# EAGLE design rev3-noserial (EAGLE 9.7.0)
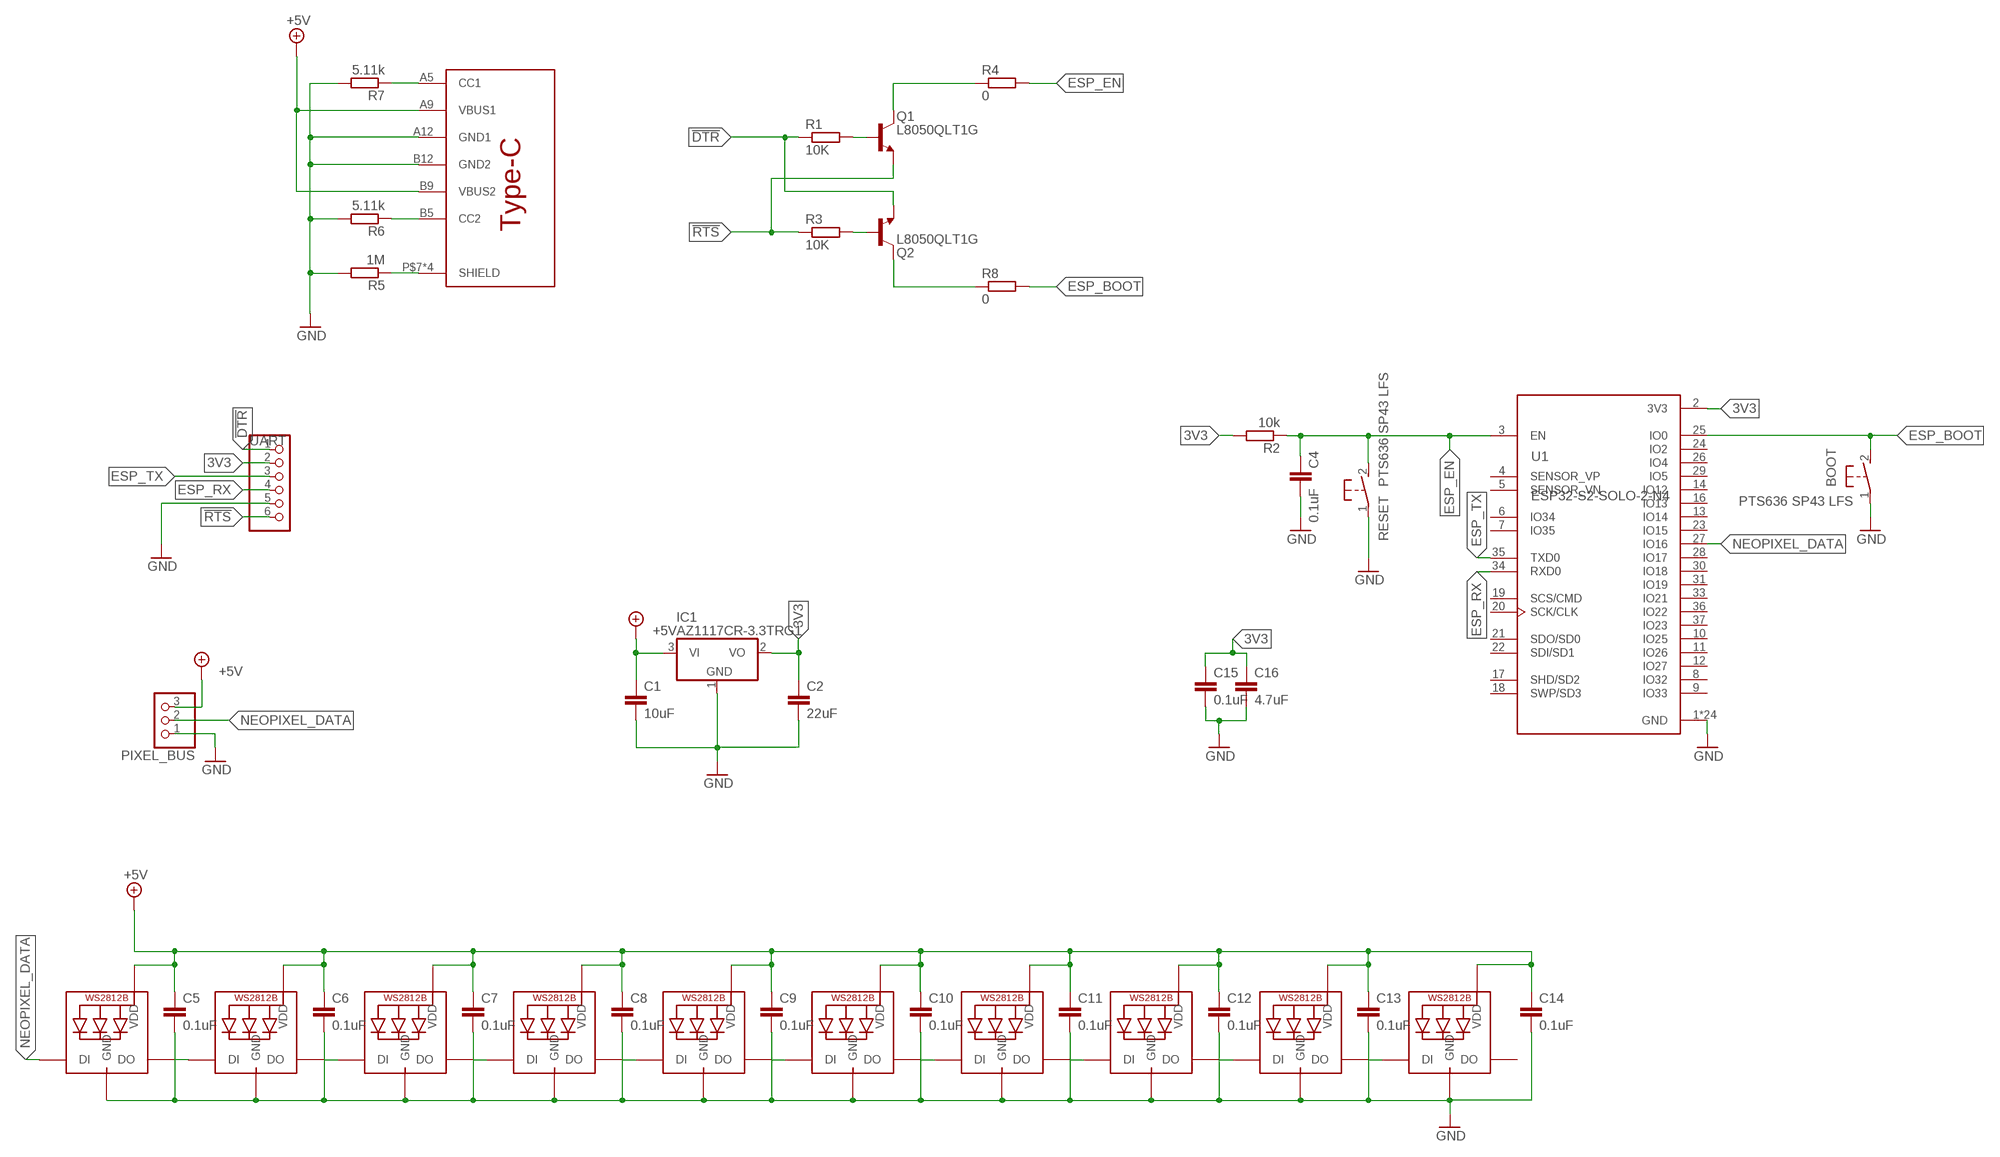
[diagram p0: schematic, sheet 1]

## Parts
BOOT  PTS636 SP43 LFS  PTS636SP43LFS  [PTS636SP43LFS]
C1  10uF  C-EUC0805  [C0805]
C2  22uF  C-EUC0805  [C0805]
C4  0.1uF  C-EUC0805  [C0805]
C5  0.1uF  C-EUC0805  [C0805]
C6  0.1uF  C-EUC0805  [C0805]
C7  0.1uF  C-EUC0805  [C0805]
C8  0.1uF  C-EUC0805  [C0805]
C9  0.1uF  C-EUC0805  [C0805]
C10  0.1uF  C-EUC0805  [C0805]
C11  0.1uF  C-EUC0805  [C0805]
C12  0.1uF  C-EUC0805  [C0805]
C13  0.1uF  C-EUC0805  [C0805]
C14  0.1uF  C-EUC0805  [C0805]
C15  0.1uF  C-EUC0805  [C0805]
C16  4.7uF  C-EUC0805  [C0805]
IC1  AZ1117CR-3.3TRG1  AZ1117CR  [SOT89]
LED1  WS2812B5050  [WS2812B]
LED2  WS2812B5050  [WS2812B]
LED3  WS2812B5050  [WS2812B]
LED4  WS2812B5050  [WS2812B]
LED5  WS2812B5050  [WS2812B]
LED6  WS2812B5050  [WS2812B]
LED7  WS2812B5050  [WS2812B]
LED8  WS2812B5050  [WS2812B]
LED9  WS2812B5050  [WS2812B]
LED10  WS2812B5050  [WS2812B]
PIXEL_BUS  PINHD-1X3  [1X03]
Q1  L8050QLT1G  NPN_BC846A,215_SOT23-BEC  [SOT95P237X112-3N]
Q2  L8050QLT1G  NPN_BC846A,215_SOT23-BEC  [SOT95P237X112-3N]
R1  10K  R-EU_R0805  [R0805]
R2  10k  R-EU_R0805  [R0805]
R3  10K  R-EU_R0805  [R0805]
R4  0  R-EU_R0805  [R0805]
R5  1M  R-EU_R0805  [R0805]
R6  5.11k  R-EU_R0805  [R0805]
R7  5.11k  R-EU_R0805  [R0805]
R8  0  R-EU_R0805  [R0805]
RESET  PTS636 SP43 LFS  PTS636SP43LFS  [PTS636SP43LFS]
U1  ESP32-S2-SOLO-2-N4  ESP32-WROOM-32D  [MODULE_ESP32-WROOM-32D]
U$1  TYPEC-DB-104PWB  [TYPEC-DB-104PWB]
UART  PINHD-1X6  [1X06]

## Nets
3V3 [power]: C2.1 C15.1 C16.1 IC1.2(VO) R2.2 U1.2(3V3) UART.2
!DTR: Q2.2(E) R1.1 UART.1
!RTS: Q1.2(E) R3.1 UART.6
+5V [power]: C1.1 C5.1 C6.1 C7.1 C8.1 C9.1 C10.1 C11.1 C12.1 C13.1 C14.1 IC1.3(VI) LED1.1-VDD(VDD) LED2.1-VDD(VDD) LED3.1-VDD(VDD) LED4.1-VDD(VDD) LED5.1-VDD(VDD) LED6.1-VDD(VDD) LED7.1-VDD(VDD) LED8.1-VDD(VDD) LED9.1-VDD(VDD) LED10.1-VDD(VDD) PIXEL_BUS.3 U$1.A9(VBUS1) U$1.B9(VBUS2)
ESP_BOOT: BOOT.2 R8.2 U1.25(IO0)
ESP_EN: C4.1 R2.1 R4.2 RESET.2 U1.3(EN)
ESP_RX: U1.34(RXD0) UART.4
ESP_TX: U1.35(TXD0) UART.3
GND [power]: BOOT.1 C1.2 C2.2 C4.2 C5.2 C6.2 C7.2 C8.2 C9.2 C10.2 C11.2 C12.2 C13.2 C14.2 C15.2 C16.2 IC1.1(GND) LED1.3-GND(GND) LED2.3-GND(GND) LED3.3-GND(GND) LED4.3-GND(GND) LED5.3-GND(GND) LED6.3-GND(GND) LED7.3-GND(GND) LED8.3-GND(GND) LED9.3-GND(GND) LED10.3-GND(GND) PIXEL_BUS.1 R5.2 R6.2 R7.2 RESET.1 U1.1(GND) U1.15(GND) U1.38(GND) U1.39_1(GND) U1.39_2(GND) U1.39_3(GND) U1.39_4(GND) U1.39_5(GND) U1.39_6(GND) U1.39_7(GND) U1.39_8(GND) U1.39_9(GND) U1.39_10(GND) U1.39_11(GND) U1.39_12(GND) U1.39_13(GND) U1.39_14(GND) U1.39_15(GND) U1.39_16(GND) U1.39_17(GND) U1.39_18(GND) U1.39_19(GND) U1.39_20(GND) U1.39_21(GND) U$1.A12(GND1) U$1.B12(GND2) UART.5
N$1: R6.1 U$1.B5(CC2)
N$2: R5.1 U$1.P$7(SHIELD) U$1.P$8(SHIELD) U$1.P$9(SHIELD) U$1.P$10(SHIELD)
N$3: R7.1 U$1.A5(CC1)
N$4: LED2.2-DOUT(DO) LED3.4-DIN(DI)
N$5: Q1.1(B) R1.2
N$6: Q2.1(B) R3.2
N$8: LED3.2-DOUT(DO) LED4.4-DIN(DI)
N$10: Q1.3(C) R4.1
N$11: Q2.3(C) R8.1
N$12: LED4.2-DOUT(DO) LED5.4-DIN(DI)
N$16: LED5.2-DOUT(DO) LED6.4-DIN(DI)
N$17: LED6.2-DOUT(DO) LED7.4-DIN(DI)
N$18: LED7.2-DOUT(DO) LED8.4-DIN(DI)
N$19: LED8.2-DOUT(DO) LED9.4-DIN(DI)
N$20: LED9.2-DOUT(DO) LED10.4-DIN(DI)
N$21: LED1.2-DOUT(DO) LED2.4-DIN(DI)
NEOPIXEL_DATA: LED1.4-DIN(DI) PIXEL_BUS.2 U1.27(IO16)
Unconnected: LED10.2-DOUT(DO) U1.4(SENSOR_VP) U1.5(SENSOR_VN) U1.6(IO34) U1.7(IO35) U1.8(IO32) U1.9(IO33) U1.10(IO25) U1.11(IO26) U1.12(IO27) U1.13(IO14) U1.14(IO12) U1.16(IO13) U1.17(SHD/SD2) U1.18(SWP/SD3) U1.19(SCS/CMD) U1.20(SCK/CLK) U1.21(SDO/SD0) U1.22(SDI/SD1) U1.23(IO15) U1.24(IO2) U1.26(IO4) U1.28(IO17) U1.29(IO5) U1.30(IO18) U1.31(IO19) U1.33(IO21) U1.36(IO22) U1.37(IO23)

## Library data of the parts
BOOT RESET = flameeyes:PTS636SP43LFS
C1 C2 C4-C16 = rcl:C-EU: CAPACITOR, European symbol; SPICEPREFIX: C
IC1 = flameeyes:AZ1117C
LED1-LED10 = flameeyes:WS2812B
PIXEL_BUS = pinhead:PINHD-1X3: PIN HEADER
Q1 Q2 = Transistor:NPN_: NPN - Popular parts; CATEGORY: Transistor; DESCRIPTION: TRANS NPN 65V 0.1A SOT23; MANUFACTURER: Nexperia USA Inc.; SUB-CATEGORY: BJT; TYPE: NPN; VALUE: BC846A
R1-R8 = rcl:R-EU_: RESISTOR, European symbol; SPICEPREFIX: R
U1 = ESP32-WROOM-32D:ESP32-WROOM-32D: Bluetooth, WiFi 802.11b/g/n, Bluetooth v4.2 + EDR, Class 1, 2 and 3 Transceiver Module 2.4GHz ~ 2.5GHz Integrated, Trace Surface Mount Check availability <https://pricing.snapeda.com/parts/ESP32-WROOM-32D/Espressif%20Systems/view-part?ref=eda>; AVAILABILITY: In Stock; DESCRIPTION: Bluetooth, WiFi 802.11b/g/n, Bluetooth v4.2 +EDR, Class 1, 2 and 3 Transceiver Module 2.4GHz ~ 2.5GHz Integrated; MF: Espressif Systems; MP: ESP32-WROOM-32D; PACKAGE: Non Standard Espressif Systems; PRICE: None
U$1 = flameeyes:TYPEC-DB-104PWB; JLCPCBPART#: C2936180
UART = pinhead:PINHD-1X6: PIN HEADER

## Net classes
0 default: clearance 0.205 mm
1 power: width 0.051 mm, clearance 0.205 mm to class 0, clearance 0.205 mm

## Board
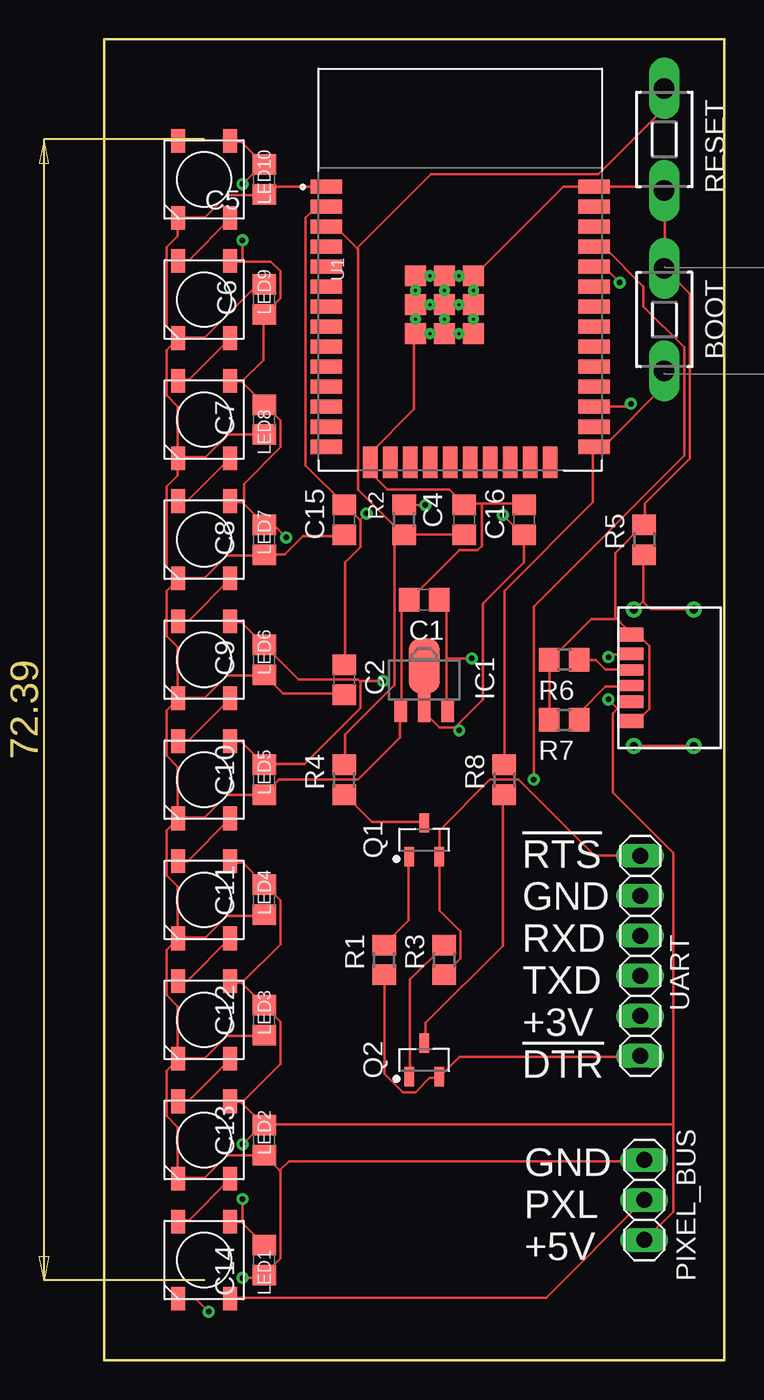
[diagram p1: board, top side]
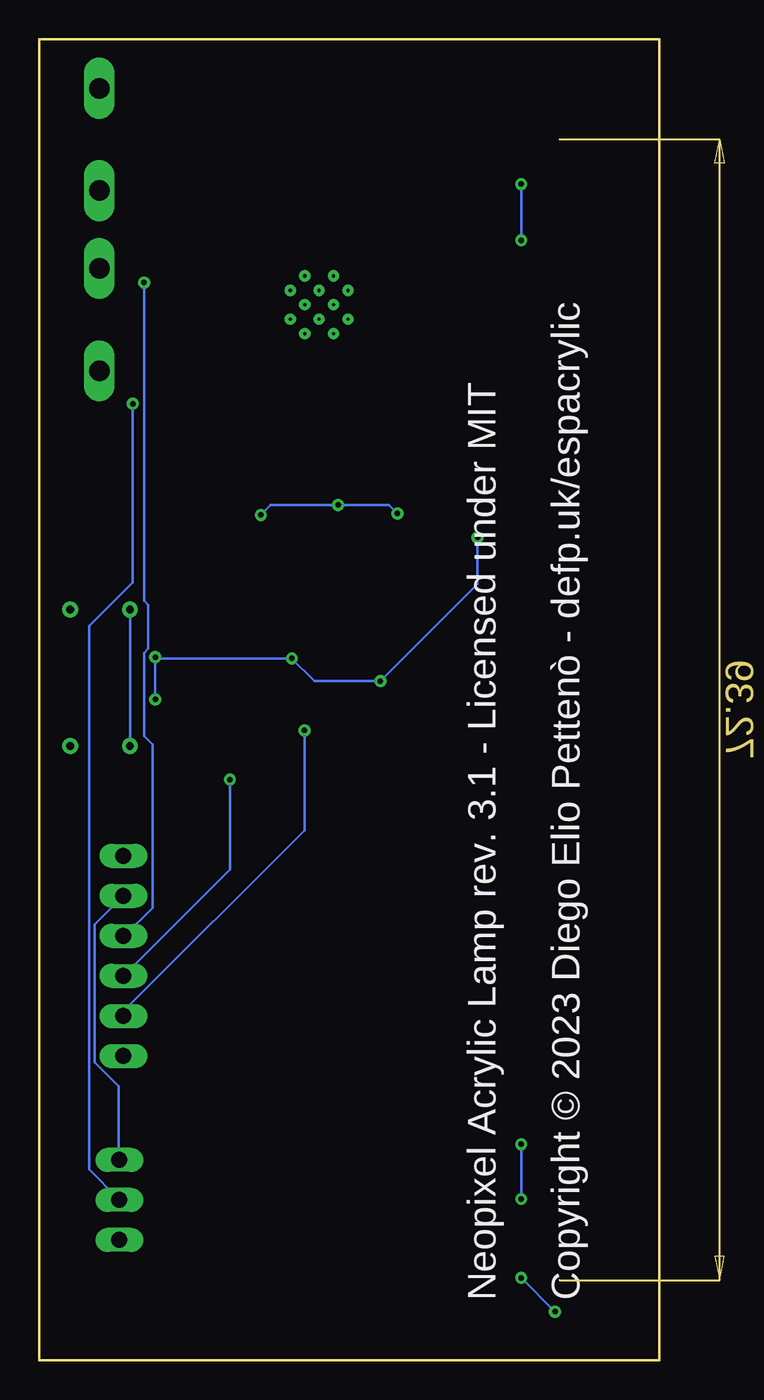
[diagram p2: board, bottom side, seen from below]

Size 39.37 x 83.82 mm. Coordinates in mm from the lower left corner, seen from the top.
Outline: 0,0 39.37,0 39.37,83.82 0,83.82 0,0
Copper layers (1*16): Top 0.035mm / dielectric 1.5mm / Bottom 0.035mm
Design rules "default": minimum track width 6mil, minimum drill 0.35mm, track to track 6mil, track to pad 6mil, pad to pad 6mil, via to via 6mil, smd to smd 6mil, copper to edge 40mil, drill to drill 6mil, minimum pad ring 10mil, minimum via ring 8mil, stop-mask expansion 4mil, vias tented up to drill 0mil, thermal gap 10mil

### Footprints (pad centres in the part's own frame; a part is rotated, then mirrored left to right if it is on the bottom)
PTS636SP43LFS = drill 1.3 long: 1 -3.25,0; 2 3.25,0
C0805 = smd 1.3 x 1.5: 1 -0.95,0; 2 0.95,0
SOT89 = smd 0.8 x 1.4: 1 -1.499,-1.981; 3 1.499,-1.981 | smd 0.8 x 1.9: 2 0,-1.727 | smd 2 x 3.5: 2.1 0,0.889
WS2812B = smd 1.5 x 0.9: 1-VDD -2.45,1.65; 2-DOUT -2.45,-1.65; 3-GND 2.45,-1.65; 4-DIN 2.45,1.65
1X03 = drill 1.016 long: 1 -2.54,0; 2 0,0; 3 2.54,0
SOT95P237X112-3N = smd 1.224 x 0.625: 1 -1.064,0.95; 2 -1.064,-0.95; 3 1.064,0
R0805 = smd 1.3 x 1.5: 1 -0.95,0; 2 0.95,0
MODULE_ESP32-WROOM-32D = smd 2 x 0.9: 1 -8.5,5.26; 2 -8.5,3.99; 3 -8.5,2.72; 4 -8.5,1.45; 5 -8.5,0.18; 6 -8.5,-1.09; 7 -8.5,-2.36; 8 -8.5,-3.63; 9 -8.5,-4.9; 10 -8.5,-6.17; 11 -8.5,-7.44; 12 -8.5,-8.71; 13 -8.5,-9.98; 14 -8.5,-11.25; 25 8.5,-11.25; 26 8.5,-9.98; 27 8.5,-8.71; 28 8.5,-7.44; 29 8.5,-6.17; 30 8.5,-4.9; 31 8.5,-3.63; 32 8.5,-2.36; 33 8.5,-1.09; 34 8.5,0.18; 35 8.5,1.45; 36 8.5,2.72; 37 8.5,3.99; 38 8.5,5.26 | smd 0.9 x 2: 15 -5.715,-12.25; 16 -4.445,-12.25; 17 -3.175,-12.25; 18 -1.905,-12.25; 19 -0.635,-12.25; 20 0.635,-12.25; 21 1.905,-12.25; 22 3.175,-12.25; 23 4.445,-12.25; 24 5.715,-12.25 | smd 1.33 x 1.33: 39_1 -2.835,-0.405; 39_2 -1,-0.405; 39_3 0.835,-0.405; 39_4 -2.835,-2.24; 39_5 -1,-2.24; 39_6 0.835,-2.24; 39_7 -2.835,-4.075; 39_8 -1,-4.075; 39_9 0.835,-4.075 | drill 0.2 pad 0.3: 39_10 -1.917,-0.405; 39_11 -0.083,-0.405; 39_12 -2.835,-1.323; 39_13 -1,-1.323; 39_14 0.835,-1.323; 39_15 -1.917,-2.24; 39_16 -0.083,-2.24; 39_17 -2.835,-3.158; 39_18 -1,-3.158; 39_19 0.835,-3.158; 39_20 -1.917,-4.075; 39_21 -0.083,-4.075
TYPEC-DB-104PWB = smd 0.7 x 1.6: A5 -0.5,0; B5 0.5,0 | smd 0.8 x 1.6: A9 1.52,0; B9 -1.52,0 | smd 0.9 x 1.6: A12 2.75,0; B12 -2.75,0 | drill 0.5 pad 1 slot 1.2 rotated 90: P$7 -4.32,-0.18; P$8 4.32,-0.18; P$9 -4.32,-3.98; P$10 4.32,-3.98
1X06 = drill 1.016 long: 1 -6.35,0; 2 -3.81,0; 3 -1.27,0; 4 1.27,0; 5 3.81,0; 6 6.35,0

### Placement (x,y rotation side)
BOOT  35.56,66.04 270 top
C1  20.32,48.26 180 top
C2  15.24,43.18 270 top
C4  22.86,53.34 90 top
C5  10.16,74.93 270 top
C6  10.16,67.31 90 top
C7  10.16,59.69 270 top
C8  10.16,52.07 270 top
C9  10.16,44.45 270 top
C10  10.16,36.83 270 top
C11  10.16,29.21 270 top
C12  10.16,21.59 270 top
C13  10.16,13.97 270 top
C14  10.16,6.35 270 top
C15  15.24,53.34 270 top
C16  26.67,53.34 90 top
IC1  20.32,43.18 0 top
LED1  6.35,6.35 270 top
LED2  6.35,13.97 270 top
LED3  6.35,21.59 270 top
LED4  6.35,29.21 270 top
LED5  6.35,36.83 270 top
LED6  6.35,44.45 270 top
LED7  6.35,52.07 270 top
LED8  6.35,59.69 270 top
LED9  6.35,67.31 270 top
LED10  6.35,74.93 270 top
PIXEL_BUS  34.29,10.16 270 top
Q1  20.32,33.02 90 top
Q2  20.32,19.05 90 top
R1  17.78,25.4 90 top
R2  19.05,53.34 90 top
R3  21.59,25.4 90 top
R4  15.24,36.83 90 top
R5  34.29,52.07 90 top
R6  29.21,44.45 180 top
R7  29.21,40.64 180 top
R8  25.4,36.83 90 top
RESET  35.56,77.47 90 top
U1  22.61,69.22 0 top
U$1  33.44,43.31 90 top
UART  34.04,25.65 90 top

### Tracks (layer width: path | path; a pad name or v marks a point on that pad's centre or on a via)
3V3  (via drill 0.35)
  Top 0.152: 16.24,53.33 15.3,54.27 C15.1 15.21,54.36 12.8,56.77 12.8,72.5 13.43,73.12 14.05,73.12 U1.2 | 16.24,53.33 16.29,53.28 16.29,51.59 15.3,50.6 15.3,44.17 C2.1 | v20.4,54.27 19.06,54.27 R2.2 | 16.24,53.33 v16.64,53.73 | 26.65,52.3 26.65,50.6 24.06,48.01 24.06,41.94 22.32,40.2 | 22.32,40.2 22.27,40.15 21.29,40.15 20.4,41.04 20.4,41.4 IC1.2 | 22.32,40.2 v22.54,39.97 | 26.65,52.3 v25.31,53.64 | 26.65,52.3 C16.1
  Bottom 0.152: v16.64,53.73 17.18,54.27 v20.4,54.27 24.69,54.27 v25.31,53.64 | v22.54,39.97 22.54,33.63 33.98,22.19 33.98,21.92 UART.2
!DTR
  Top 0.152: R1.1 17.81,24.43 17.81,18.17 18.97,17.01 19.77,17.01 20.67,17.9 21.2,17.9 Q2.2 21.29,17.99 22.54,19.24 33.98,19.24 UART.1
!RTS
  Top 0.152: R3.1 21.65,24.51 22.63,25.5 22.63,27.19 21.29,28.54 21.29,31.93 Q1.2 21.29,32.02 21.29,33.63 24.51,36.84 26.29,36.84 31.12,32.02 33.98,32.02 UART.6
+5V  (via drill 0.35)
  Top 0.152: LED10.1-VDD 8.07,77.32 8.69,77.32 10.12,75.89 C5.1 10.03,75.89 v8.78,74.64 | 8.83,54.4 10.12,53.11 C8.1 10.21,53.02 10.75,53.02 v11.55,52.21 | 8.83,54.4 8.78,54.45 8.07,54.45 LED7.1-VDD | 8.74,62.09 10.12,60.7 C7.1 10.21,60.61 11.2,59.63 11.2,57.93 8.87,55.61 8.87,54.45 8.83,54.4 | 8.74,62.09 8.69,62.13 8.07,62.13 LED8.1-VDD | 8.74,62.09 10.12,63.47 10.12,66.33 C6.1 10.21,66.42 11.2,67.4 11.2,69.1 10.57,69.72 8.78,69.72 | 8.78,69.72 8.07,69.72 LED9.1-VDD | 8.78,69.72 v8.78,71.06 | LED4.1-VDD 8.07,31.57 8.78,31.57 10.12,30.23 C11.1 10.21,30.14 11.2,29.16 11.2,26.39 8.74,23.93 | 8.74,23.93 10.12,22.55 C12.1 10.21,22.46 11.2,21.48 11.2,18.8 8.74,16.34 | 8.74,23.93 8.69,23.98 8.07,23.98 LED3.1-VDD | 8.74,8.74 10.12,7.36 C14.1 | 8.74,8.74 8.69,8.79 8.07,8.79 LED1.1-VDD | 8.74,16.34 10.12,14.95 C13.1 | 8.74,16.34 8.69,16.38 8.07,16.38 LED2.1-VDD | v8.78,10.22 8.78,8.79 8.74,8.74 | v8.78,13.7 10.03,14.95 C13.1 | LED5.1-VDD 8.07,39.26 8.69,39.26 10.12,37.83 C10.1 10.21,37.83 12.71,37.83 16.29,41.4 16.29,43.01 16.24,43.05 | LED6.1-VDD 8.07,46.85 8.69,46.85 10.12,45.42 C9.1 10.21,45.33 12.36,43.19 16.11,43.19 16.24,43.05 | 21.74,44.53 21.74,47.74 21.29,48.19 C1.1 | 21.74,44.53 21.74,41.22 IC1.3 | 32.59,41.36 32.28,41.04 32.28,36.04 36.12,32.2 36.12,14.95 | 32.59,41.36 33,41.76 33.44,41.76 U$1.B9 | 36.12,14.95 36.12,9.41 34.34,7.63 PIXEL_BUS.3 | v32.01,44.62 32.19,44.8 33.44,44.8 U$1.A9 | 32.59,41.36 v32.01,41.94 | v23.35,44.53 21.74,44.53 | v17.72,43.1 16.29,43.1 16.24,43.05 | 36.12,14.95 10.21,14.95 C13.1
  Bottom 0.152: v8.78,71.06 v8.78,74.64 | v8.78,13.7 v8.78,10.22 | v32.01,41.94 32.01,44.53 | 32.01,44.53 v23.35,44.53 21.92,43.1 v17.72,43.1 11.55,49.26 v11.55,52.21 | 32.01,44.53 v32.01,44.62
ESP_BOOT
  Top 0.152: R8.2 25.4,37.83 25.4,48.82 31.03,54.45 31.03,57.93 U1.25 31.12,58.02 31.75,58.02 35.5,61.77 35.5,62.76 BOOT.2
ESP_EN
  Top 0.152: R4.2 15.3,37.83 15.3,39.7 18.43,42.83 18.43,51.77 18.97,52.3 R2.1 | C4.1 22.81,52.39 R2.1 | 16.06,70.57 16.11,70.53 16.11,55.25 18.97,52.39 R2.1 | 16.06,70.57 14.77,71.87 14.14,71.87 U1.3 | 16.06,70.57 20.75,75.27 31.39,75.27 35.5,79.38 35.5,80.72 RESET.2
ESP_RX  (via drill 0.35)
  Top 0.152: v32.73,68.38 31.75,69.37 31.12,69.37 U1.34
  Bottom 0.152: v32.73,68.38 32.73,48.19 32.46,47.92 32.46,45.15 32.73,44.89 32.73,39.61 32.19,39.08 32.19,28.71 33.98,26.93 UART.4
ESP_TX  (via drill 0.35)
  Top 0.152: v27.28,36.84 27.28,47.83 36.84,57.39 36.84,64.27 34.25,66.87 34.25,68.12 31.75,70.62 31.12,70.62 U1.35
  Bottom 0.152: v27.28,36.84 27.28,31.13 33.98,24.43 UART.3
GND  (via drill 0.35)
  Top 0.152: v6.64,3.07 5.83,3.87 4.76,3.87 LED1.3-GND | v8.78,5.21 9.94,5.21 10.12,5.39 C14.2 10.21,5.48 11.2,6.46 11.2,12 11.15,12.05 | LED3.3-GND 4.76,19.15 6.37,19.15 7.8,20.58 10.12,20.58 C12.2 | LED3.3-GND 4.67,19.06 3.96,18.35 3.96,15.49 4.67,14.78 4.67,11.56 LED2.3-GND 4.76,11.56 6.37,11.56 7.8,12.99 10.12,12.99 C13.2 10.21,12.99 11.15,12.05 | 11.15,12.05 11.73,12.63 34.25,12.63 PIXEL_BUS.1 | R7.2 28.26,40.69 R6.2 28.26,44.53 28.44,44.53 30.94,47.03 32.46,47.03 32.5,47.07 | 32.5,47.07 33.44,46.14 U$1.A12 33.53,46.05 33.89,46.05 34.6,45.33 34.6,41.31 33.89,40.6 33.53,40.6 U$1.B12 | 32.5,47.07 32.46,47.12 32.46,51.23 34.25,53.02 R5.2 34.34,53.11 34.34,54.36 37.19,57.22 37.19,67.67 35.59,69.28 BOOT.1 35.59,69.37 35.59,74.19 RESET.1 35.5,74.28 35.32,74.46 31.12,74.46 U1.38 31.03,74.46 29.15,74.46 23.53,68.83 U1.39_3 23.44,68.74 23.44,67.94 U1.39_14 23.44,67.85 23.44,67.05 U1.39_6 23.53,66.95 23.53,66.06 U1.39_19 23.44,65.97 23.44,65.17 | U1.39_2 21.65,68.83 22.45,68.83 U1.39_11 | U1.39_2 21.56,68.83 20.75,68.83 U1.39_10 20.67,68.83 19.77,68.83 U1.39_1 19.77,68.74 19.77,67.94 U1.39_12 19.77,67.85 19.77,67.05 U1.39_4 19.77,66.95 U1.39_17 19.77,65.97 19.77,65.17 | U1.39_5 21.65,67.05 21.65,67.85 U1.39_13 21.65,67.94 21.65,68.74 U1.39_2 | U1.39_15 20.75,66.95 21.56,66.95 U1.39_5 | U1.39_16 22.45,66.95 21.65,66.95 U1.39_5 | 21.65,65.17 21.65,65.97 U1.39_18 | 21.65,65.17 22.45,65.17 U1.39_21 22.54,65.17 23.44,65.17 | 21.65,65.17 U1.39_8 21.56,65.17 20.75,65.17 U1.39_20 20.67,65.17 19.77,65.17 | 23.44,65.17 U1.39_9 | 19.77,65.17 U1.39_7 19.68,65.08 19.68,60.34 16.91,57.57 16.91,57.04 U1.15 16.91,56.95 16.91,56.32 17.98,55.25 21.92,55.25 22.81,54.36 C4.2 22.9,54.36 23.97,54.36
  Top 0.152: 23.97,54.36 26.65,54.36 C16.2 | 23.97,54.36 23.97,51.68 23.7,51.41 22.54,51.41 19.41,48.28 C1.2 19.32,48.19 18.88,47.74 18.88,41.22 IC1.1 18.79,41.13 18.79,39.52 16.11,36.84 11.11,36.84 10.21,35.95 C10.2 10.12,35.86 7.8,35.86 6.37,34.43 4.76,34.43 LED5.3-GND | U1.1 14.05,74.46 10.66,74.46 10.21,74.01 C5.2 10.12,73.92 7.8,73.92 6.37,72.5 4.76,72.5 LED10.3-GND 4.67,72.41 4.67,71.33 3.96,70.62 3.96,65.61 4.67,64.9 LED9.3-GND | LED8.3-GND 4.76,57.3 6.46,57.3 7.89,58.73 10.12,58.73 C7.2 | LED9.3-GND 4.76,64.9 6.37,64.9 9.68,68.21 10.12,68.21 C6.2 | LED8.3-GND 4.67,57.3 4.67,60.52 3.96,61.24 3.96,64.1 4.67,64.81 LED9.3-GND | LED4.3-GND 4.76,26.84 6.46,26.84 7.8,28.18 10.12,28.18 C11.2 | LED4.3-GND 4.67,26.84 4.67,30.05 3.96,30.77 3.96,33.63 4.67,34.34 LED5.3-GND | LED6.3-GND 4.76,42.03 6.37,42.03 7.8,43.46 10.12,43.46 C9.2 10.21,43.46 11.37,42.29 15.21,42.29 C2.2 | LED7.3-GND 4.76,49.62 6.37,49.62 7.8,51.05 10.12,51.05 C8.2 10.21,51.14 11.46,51.14 12.62,52.3 15.21,52.3 C15.2 | LED6.3-GND 4.67,42.03 4.67,45.24 3.96,45.96 3.96,48.82 4.67,49.53 LED7.3-GND | LED5.3-GND 4.67,34.43 4.67,37.65 3.96,38.36 3.96,41.22 4.67,41.94 LED6.3-GND | LED8.3-GND 4.67,57.22 4.67,56.14 3.96,55.43 3.96,50.34 4.67,49.62 LED7.3-GND | LED3.3-GND 4.67,19.15 4.67,22.46 3.96,23.17 3.96,26.03 4.67,26.75 LED4.3-GND
  Bottom 0.152: PIXEL_BUS.1 34.34,12.72 34.34,17.37 35.86,18.89 35.86,27.64 34.07,29.43 UART.5 | v8.78,5.21 v6.64,3.07
N$1
  Top 0.152: R6.1 30.23,44.44 31.21,44.44 31.83,43.81 U$1.B5
N$2
  Top 0.152: U$1.P$7 33.71,38.99 37.37,38.99 U$1.P$9 | 34.2,48.15 33.71,47.66 U$1.P$8 | 34.2,48.15 34.25,48.19 34.25,51.05 R5.1 | 34.2,48.15 34.69,47.66 37.37,47.66 U$1.P$10
  Bottom 0.152: U$1.P$7 33.62,47.57 U$1.P$8
N$3
  Top 0.152: R7.1 30.23,40.69 30.23,41.13 31.83,42.74 33.44,42.74 U$1.A5
N$4
  Top 0.152: LED2.2-DOUT 4.76,16.47 5.39,16.47 7.98,19.06 LED3.4-DIN
N$5
  Top 0.152: Q1.1 19.32,31.93 19.32,27.91 17.81,26.39 R1.2
N$6
  Top 0.152: Q2.1 19.41,17.99 19.41,24.16 21.56,26.3 R3.2
N$8
  Top 0.152: LED3.2-DOUT 4.76,24.07 5.3,24.07 7.98,26.75 LED4.4-DIN
N$10
  Top 0.152: Q1.3 20.31,34.16 17,34.16 15.3,35.86 R4.1
N$11
  Top 0.152: Q2.3 20.4,20.14 20.4,21.39 25.31,26.3 25.31,35.86 R8.1
N$12
  Top 0.152: LED4.2-DOUT 4.76,31.66 5.3,31.66 7.98,34.34 LED5.4-DIN
N$16
  Top 0.152: LED5.2-DOUT 4.76,39.35 5.39,39.35 7.98,41.94 LED6.4-DIN
N$17
  Top 0.152: LED6.2-DOUT 4.76,46.94 5.39,46.94 7.98,49.53 LED7.4-DIN
N$18
  Top 0.152: LED7.2-DOUT 4.76,54.54 5.3,54.54 7.98,57.22 LED8.4-DIN
N$19
  Top 0.152: LED8.2-DOUT 4.76,62.22 5.39,62.22 7.98,64.81 LED9.4-DIN
N$20
  Top 0.152: LED9.2-DOUT 4.76,69.81 5.39,69.81 7.98,72.41 LED10.4-DIN
N$21
  Top 0.152: LED1.2-DOUT 4.76,8.88 5.39,8.88 7.98,11.47 LED2.4-DIN
NEOPIXEL_DATA  (via drill 0.35)
  Top 0.152: LED1.4-DIN 8.07,3.96 28.08,3.96 34.25,10.13 PIXEL_BUS.2 | v33.44,60.7 33.26,60.52 31.12,60.52 U1.27
  Bottom 0.152: v33.44,60.7 33.44,49.35 36.21,46.58 36.21,12.09 34.34,10.22 PIXEL_BUS.2

### Text on the board
tPlace: !RTS / GND / RXD / TXD / +3V / !DTR | GND / PXL / +5V
bPlace: Neopixel Acrylic Lamp rev. 3.1 - Licensed under MIT / / Copyright © 2023 Diego Elio Pettenò - defp.uk/espacrylic